# EasyEDA schematic Schematic.json
TITLE: Sheet_1; REV: 1.0; Date: 2024-10-05; Sheet: 1/1; Drawn By: sahilchess09; Company: Your Company
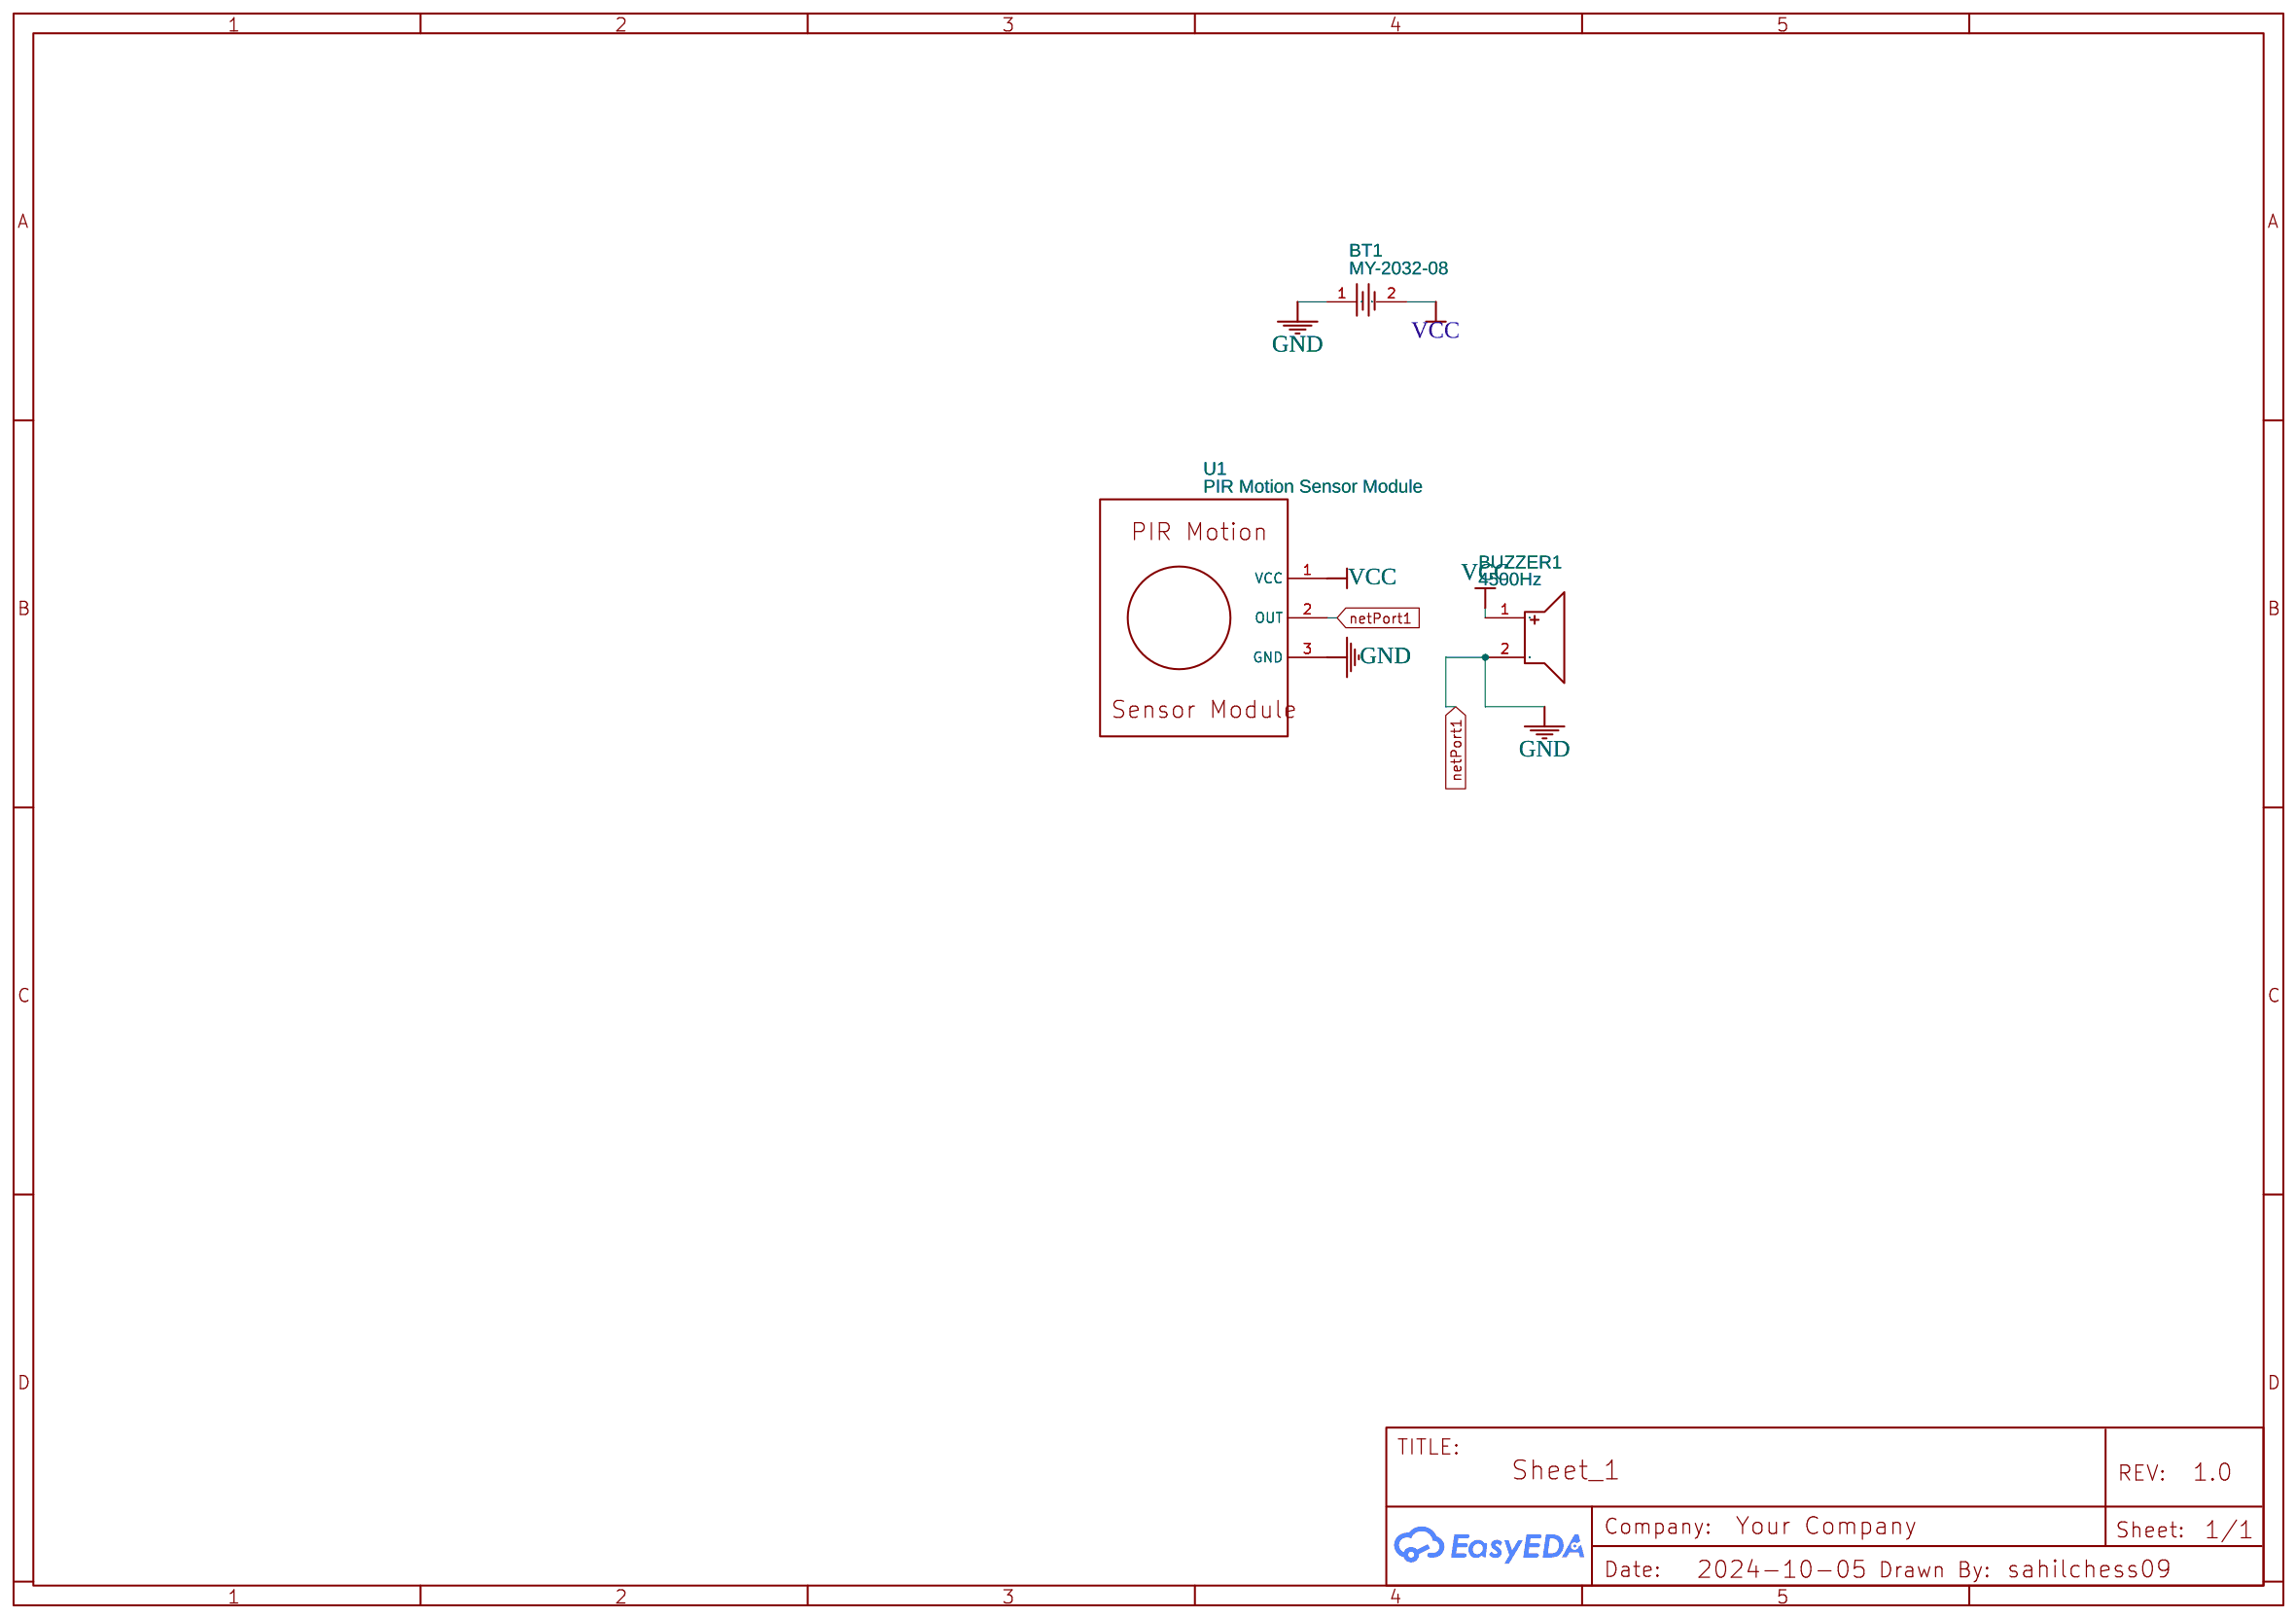
[diagram p0: schematic sheet]

## Parts
BT1  MY-2032-08  [BAT-SMD_MY-2032-08]
BUZZER1  4500Hz  [BUZ-TH_BD14.1-P7.62-D1.0-FD]
U1  PIR Motion Sensor Module  [PIRMOTIONSENSOR]

## Library data of the parts
BT1 = MY-2032-08: Contributor: LCSC; Supplier: LCSC; Supplier Part: C964831; Manufacturer: MYOUNG(美阳); JLCPCB Part Class: Extended Part
BUZZER1 = HND-1407B: Contributor: LCSC; Supplier: LCSC; Manufacturer: 华能; Supplier Part: C115184; JLCPCB Part Class: Extended Part
U1 = PIR Motion Sensor Module: Contributor: nikodim

## Nets
GND: BT1.1 BUZZER1.2 U1.2(OUT) U1.3(GND)
VCC: BT1.2 BUZZER1.1 U1.1(VCC)
